# EAGLE schematic kickerv3 (EAGLE 9.6.2)
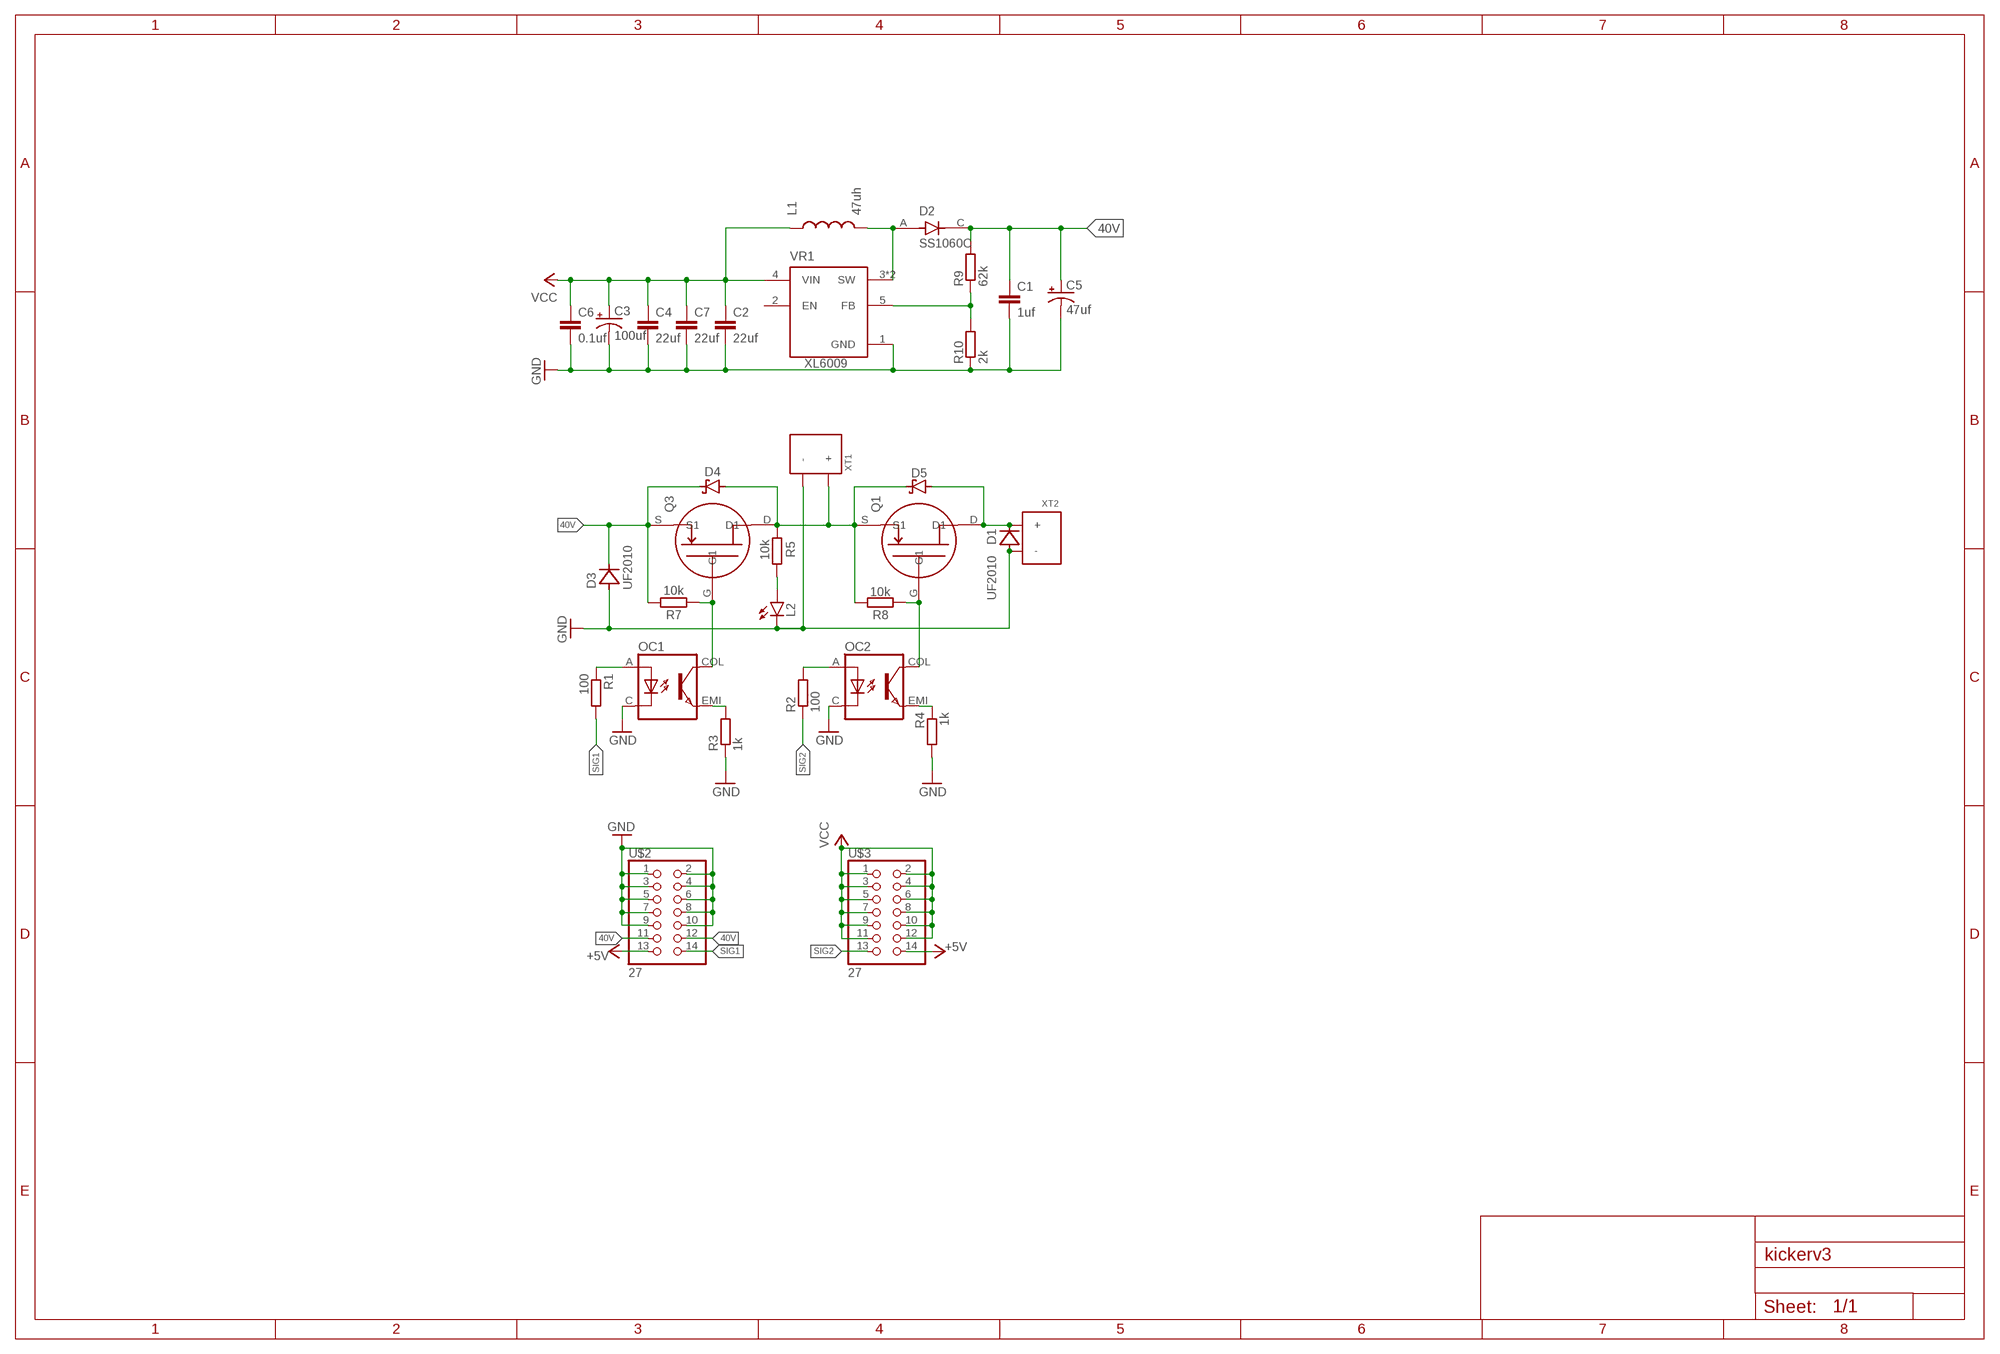
[diagram p0: schematic, sheet 1]

## Parts
C1  1uf  C-EUC1206  [C1206]
C2  22uf  C-EUC0805  [C0805]
C3  100uf  MH5  [MH5]
C4  22uf  C-EUC0805  [C0805]
C5  47uf  VZ1H470ME077000CE0  [VZ1H470ME077000CE0]
C6  0.1uf  C-EUC0603  [C0603]
C7  22uf  C-EUC0805  [C0805]
D1  UF2010  [UF2010]
D2  SS1060C  [DIOSC6959X240]
D3  UF2010  [UF2010]
D4  1SS178  [1SS178]
D5  1SS178  [1SS178]
L1  47uh  MDE1040-470M  [MDE1040-470M]
L2  SML-E12P8WT86  [LED_SML-LXFM0603SIC-TR]
OC1  TL293(GB)  [SOIC127P700X230-4N]
OC2  TL293(GB)  [SOIC127P700X230-4N]
Q1  TJ60S04M3L  [DPACK]
Q3  TJ60S04M3L  [DPACK]
R1  100  R-EU_R0603  [R0603]
R2  100  R-EU_R0603  [R0603]
R3  1k  R-EU_R0603  [R0603]
R4  1k  R-EU_R0603  [R0603]
R5  10k  R-EU_R0603  [R0603]
R7  10k  R-EU_R0603  [R0603]
R8  10k  R-EU_R0603  [R0603]
R9  62k  R-EU_R0603  [R0603]
R10  2k  R-EU_R0603  [R0603]
U$2  27  [2*7]
U$3  27  [2*7]
VR1  XL6009  [DPAK170P1435X465-6N]
XT1  XT30PW-F  [XT30PW-F]
XT2  XT30PW-F  [XT30PW-F]

## Nets
40V: C1.1 C5.+ D2.C D3.C D4.C Q3.S(S1) R7.1 R9.2 U$2.11 U$2.12
+5V: U$2.13 U$3.14
GND: C1.2 C2.2 C3.- C4.2 C5.- C6.2 C7.2 D1.A D3.A L2.C OC1.C OC2.C R3.1 R4.2 R10.1 U$2.1 U$2.2 U$2.3 U$2.4 U$2.5 U$2.6 U$2.7 U$2.8 U$2.9 U$2.10 VR1.1(GND) XT1.- XT2.-
N$1: D4.A D5.C Q1.S(S1) Q3.D(D1) R5.2 R8.1 XT1.+
N$2: OC1.COL Q3.G(G1) R7.2
N$3: OC1.EMI R3.2
N$4: R9.1 R10.2 VR1.5(FB)
N$5: OC1.A R1.1
N$6: OC2.A R2.2
N$7: OC2.EMI R4.1
N$8: D1.C D5.A Q1.D(D1) XT2.+
N$9: OC2.COL Q1.G(G1) R8.2
N$10: D2.A L1.P$2 VR1.3(SW) VR1.6(SW)
N$11: L2.A R5.1
SIG1: R1.2 U$2.14
SIG2: R2.1 U$3.13
VCC: C2.1 C3.+ C4.1 C6.1 C7.1 L1.P$1 U$3.1 U$3.2 U$3.3 U$3.4 U$3.5 U$3.6 U$3.7 U$3.8 U$3.9 U$3.10 U$3.11 U$3.12 VR1.4(VIN)
Unconnected: VR1.2(EN)

## Library data of the parts
C1 C2 C4 C6 C7 = rcl:C-EU: CAPACITOR, European symbol; SPICEPREFIX: C
C3 = capacitor:MH5
C5 = capacitor:VZ1H470ME077000CE0
D1 D3 = diode:UF2010
D2 = diode:SS1060C: Diode: Schottky rectifying; 60V; 3A; DO214AB, SMC Check availability <https://pricing.snapeda.com/parts/SK36/Diotec%20Semiconductor/view-part?ref=eda>; AVAILABILITY: In Stock; CHECK_PRICES: https://www.snapeda.com/parts/SK36/Diotec/view-part/?ref=eda; DESCRIPTION: Diode Schottky 60 V 3A Surface Mount SMC (DO-214AB); MF: Diotec Semiconductor; MP: SK36; PACKAGE: DO-214AB-2 Diotec; PRICE: None; PURCHASE-URL: https://www.snapeda.com/api/url_track_click_mouser/?unipart_id=6186978&manufacturer=Diotec Semiconductor&part_name=SK36&search_term=do-214a; SNAPEDA_LINK: https://www.snapeda.com/parts/SK36/Diotec/view-part/?ref=snap
D4 D5 = diode:1SS178
L1 = insuctor:MDE1040-470M
L2 = LED:SML-E12P8WT86
OC1 OC2 = TLP293(GB):TL293(GB)
Q1 Q3 = P-MOSFET:TJ60S04M3L
R1-R5 R7-R10 = rcl:R-EU_: RESISTOR, European symbol; SPICEPREFIX: R
U$2 U$3 = pin_socket:2*7
VR1 = XL6009:XL6009: The XL6009 regulator is a wide input range, current mode, DC/DC converter which is capable of generating either positive or negative output voltages. Check availability <https://pricing.snapeda.com/parts/XL6009/XLSEMI/view-part?ref=eda>; AVAILABILITY: Not in stock; CHECK_PRICES: https://www.snapeda.com/parts/XL6009/XLSEMI/view-part/?ref=eda; DESCRIPTION: The XL6009 regulator is a wide input range, current mode, DC/DC converter which is capable of generating either positive or negative output voltages.; MF: XLSEMI; MP: XL6009; PACKAGE: TO-263-5L XLSEMI; PRICE: None; SNAPEDA_LINK: https://www.snapeda.com/parts/XL6009/XLSEMI/view-part/?ref=snap
XT1 XT2 = XT:XT30PW-F